# EAGLE board NEW MEIN (EAGLE 9.6.2), part 1 of 2
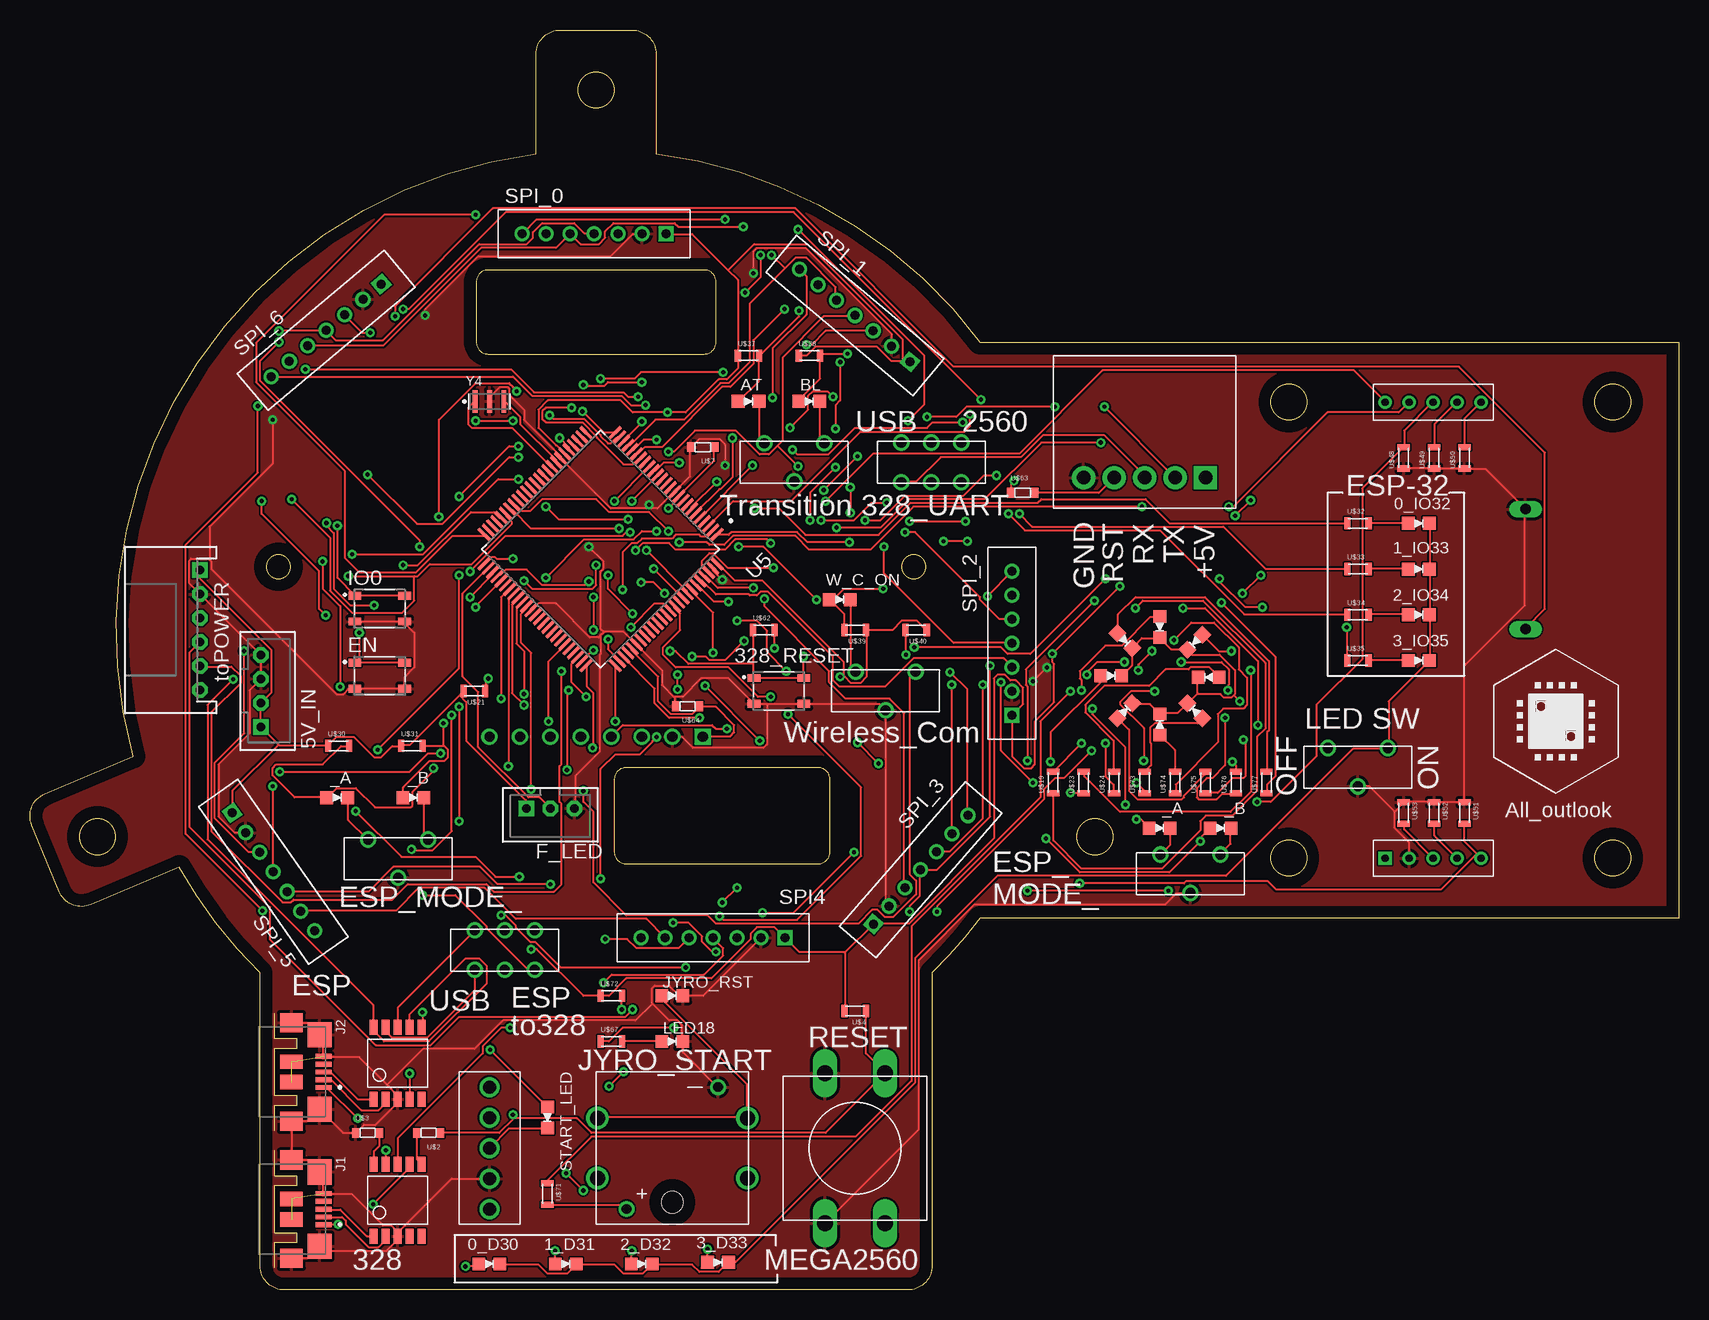
[diagram p2: board, top side]
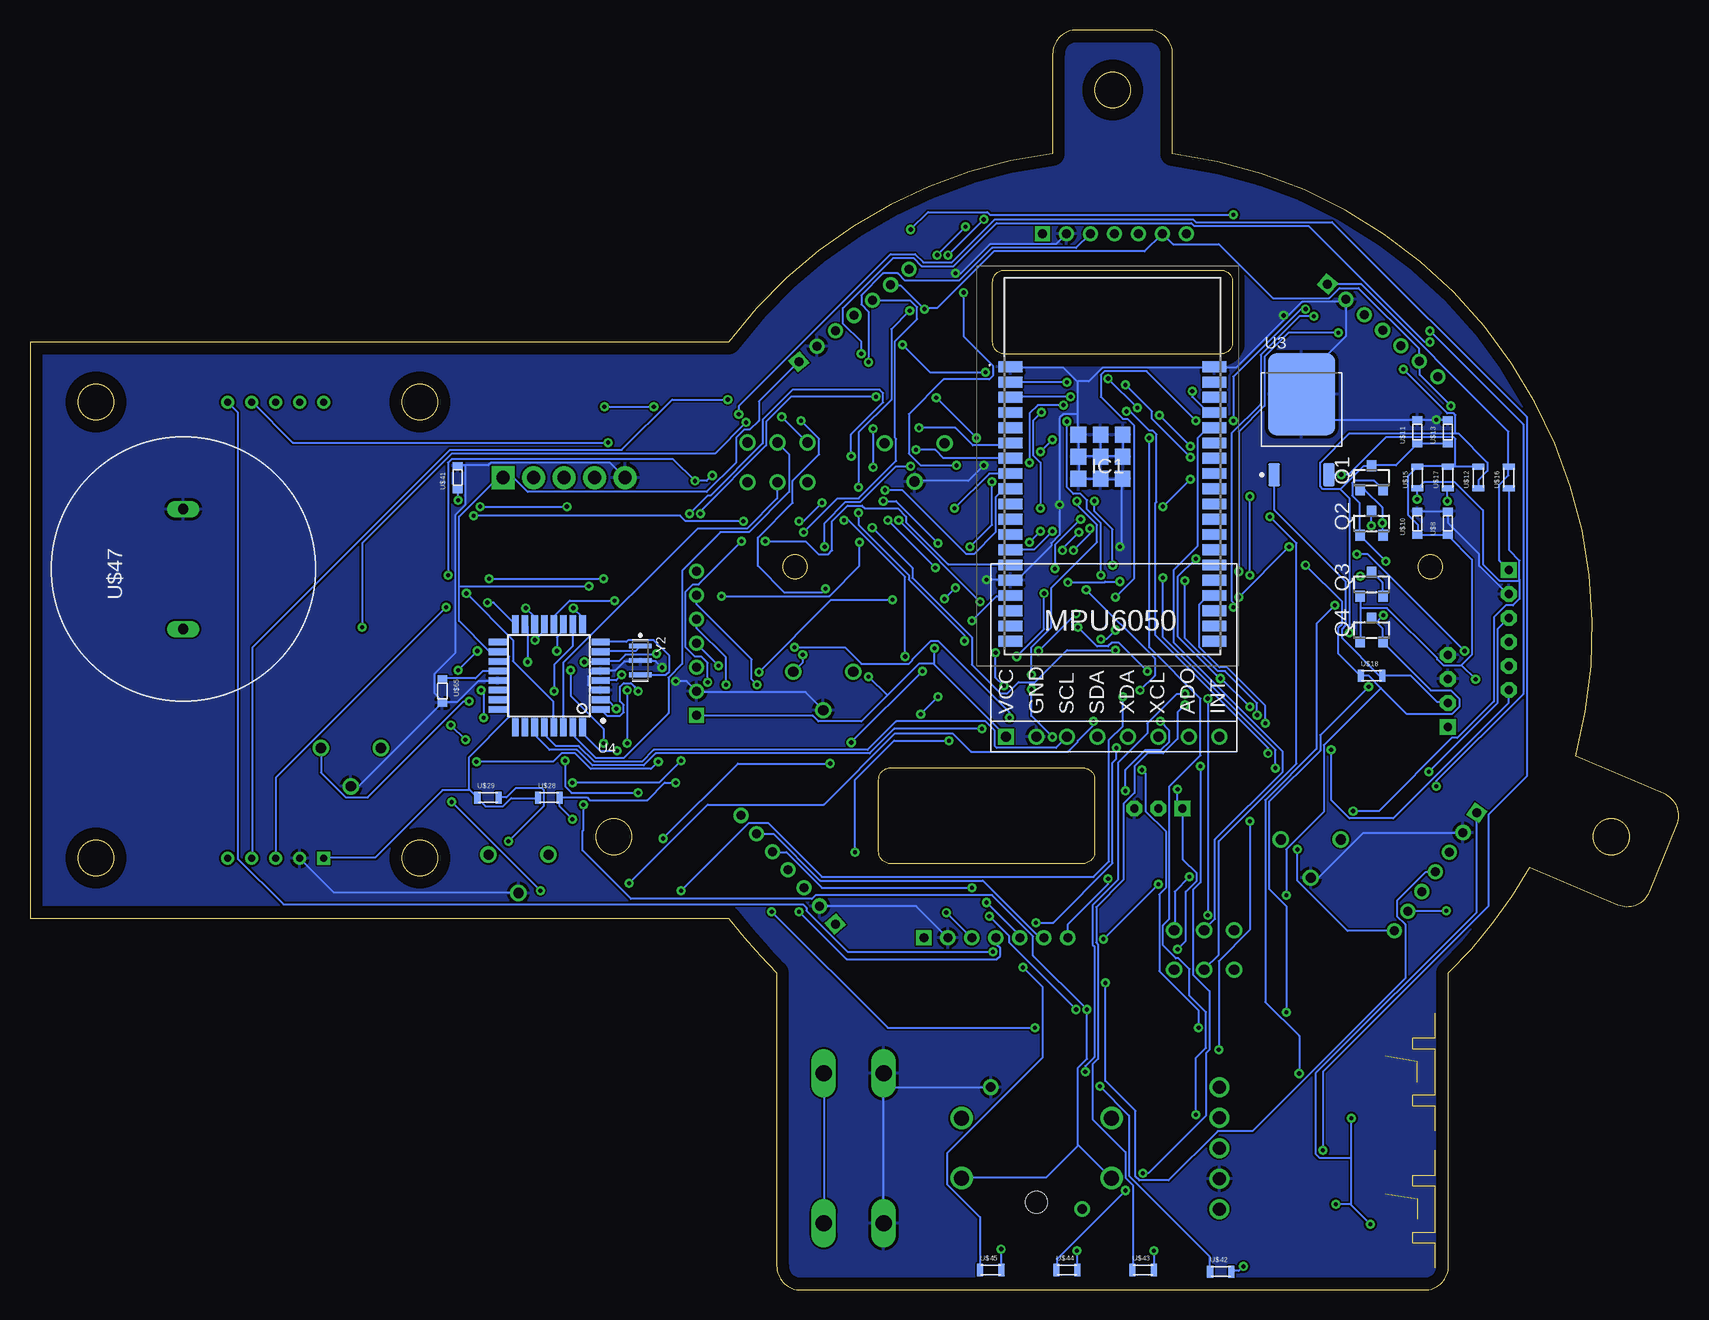
[diagram p3: board, bottom side, seen from below]

Size 137.44 x 105 mm. Coordinates in mm from the lower left corner, seen from the top.
Outline: 49.69,35.52 65.69,35.52 arc90 66.69,36.52 66.69,42.52 arc90 65.69,43.52 49.69,43.52 arc90 48.69,42.52 48.69,36.52 arc90 49.69,35.52
Outline: 56.19,85 38.19,85 arc90 37.19,84 37.19,79 arc90 38.19,78 56.19,78 arc90 57.19,79 57.19,84 arc90 56.19,85
Outline: 1.22,41.34 8.6,44.47 arc-98 42.19,94.68 42.19,103 arc-90 44.19,105 50.19,105 arc-90 52.19,103 52.19,94.68 arc-46 79.19,79 137.44,79 137.44,31 79.19,31 arc-9 75.19,26.43 75.19,2 arc-90 73.19,0 21.19,0 arc-90 19.19,2 19.19,26.43 arc-16 12.42,35.23 5.07,32.11 arc-91 2.44,33.19 0.15,38.74 arc-89 1.22,41.34
Outline: circle at 47.19,100 radius 1.5
Outline: circle at 88.77,37.78 radius 1.5
Outline: circle at 20.71,60.26 radius 1
Outline: circle at 73.67,60.26 radius 1
Outline: circle at 131.94,74 radius 1.5
Outline: circle at 131.94,36 radius 1.5
Outline: circle at 104.94,74 radius 1.5
Outline: circle at 104.94,36 radius 1.5
Outline: circle at 5.62,37.78 radius 1.5
Copper layers (1*16): Top 0.035mm / dielectric 1.5mm / Bottom 0.035mm
Design rules "default": minimum track width 6mil, minimum drill 0.35mm, track to track 6mil, track to pad 6mil, pad to pad 6mil, via to via 6mil, smd to smd 6mil, copper to edge 40mil, drill to drill 6mil, minimum pad ring 10mil, minimum via ring 8mil, stop-mask expansion 4mil, vias tented up to drill 0mil, thermal gap 10mil

## Footprints (pad centres in the part's own frame; a part is rotated, then mirrored left to right if it is on the bottom)
LED1608 = smd 1.05 x 1.08: A -0.875,0; K 0.875,0
SW_SKRPACE010 = smd 1.05 x 0.65: 1 -2.075,1.075; 2 2.075,1.075; 3 -2.075,-1.075; 4 2.075,-1.075
ESP32WROVEREM213EH2864PH3Q0 = smd 2 x 0.9: 1 -8.5,23.96; 2 -8.5,22.69; 3 -8.5,21.42; 4 -8.5,20.15; 5 -8.5,18.88; 6 -8.5,17.61; 7 -8.5,16.34; 8 -8.5,15.07; 9 -8.5,13.8; 10 -8.5,12.53; 11 -8.5,11.26; 12 -8.5,9.99; 13 -8.5,8.72; 14 -8.5,7.45; 15 -8.5,6.18; 16 -8.5,4.91; 17 -8.5,3.64; 18 -8.5,2.37; 19 -8.5,1.1; 20 8.5,1.1; 21 8.5,2.37; 22 8.5,3.64; 23 8.5,4.91; 24 8.5,6.18; 25 8.5,7.45; 26 8.5,8.72; 27 8.5,9.99; 28 8.5,11.26; 29 8.5,12.53; 30 8.5,13.8; 31 8.5,15.07; 32 8.5,16.34; 33 8.5,17.61; 34 8.5,18.88; 35 8.5,20.15; 36 8.5,21.42; 37 8.5,22.69; 38 8.5,23.96 | smd 1.33 x 1.33: 39 -1,16.46; 40 0.835,16.46; 41 0.835,14.625; 42 -1,14.625; 43 -2.835,14.625; 44 -2.835,16.46; 45 -2.835,18.295; 46 -1,18.295; 47 0.835,18.295
HRS_ZX62R-B-5P = smd 0.4 x 1.35: 1 1.3,2.675; 2 0.65,2.675; 3 0,2.675; 4 -0.65,2.675; 5 -1.3,2.675 | smd 2.1 x 2: S1 -3.1,2.35; S2 3.1,2.35 | smd 1.6 x 1.9: S3 -4.1,0; S4 4.1,0 | smd 1.2 x 1.9: S5 -0.85,0; S6 0.85,0
SOT23 = smd 0.8 x 0.9: 1 -0.95,-1; 2 0.95,-1; 3 0,1
DPAK228P968X238-4N = smd 0.96 x 1.9: 1 -2.28,-4.59; 3 2.28,-4.59 | smd 5.63 x 6.84: 2 0,2.12
QFP80P900X900X120-32N = smd 1.5 x 0.55: 1 -4.3,2.8; 2 -4.3,2; 3 -4.3,1.2; 4 -4.3,0.4; 5 -4.3,-0.4; 6 -4.3,-1.2; 7 -4.3,-2; 8 -4.3,-2.8; 17 4.3,-2.8; 18 4.3,-2; 19 4.3,-1.2; 20 4.3,-0.4; 21 4.3,0.4; 22 4.3,1.2; 23 4.3,2; 24 4.3,2.8 | smd 0.55 x 1.5: 9 -2.8,-4.3; 10 -2,-4.3; 11 -1.2,-4.3; 12 -0.4,-4.3; 13 0.4,-4.3; 14 1.2,-4.3; 15 2,-4.3; 16 2.8,-4.3; 25 2.8,4.3; 26 2,4.3; 27 1.2,4.3; 28 0.4,4.3; 29 -0.4,4.3; 30 -1.2,4.3; 31 -2,4.3; 32 -2.8,4.3
QFP50P1600X1600X120-100N = smd 1.47 x 0.28: 1 -7.67,6; 2 -7.67,5.5; 3 -7.67,5; 4 -7.67,4.5; 5 -7.67,4; 6 -7.67,3.5; 7 -7.67,3; 8 -7.67,2.5; 9 -7.67,2; 10 -7.67,1.5; 11 -7.67,1; 12 -7.67,0.5; 13 -7.67,0; 14 -7.67,-0.5; 15 -7.67,-1; 16 -7.67,-1.5; 17 -7.67,-2; 18 -7.67,-2.5; 19 -7.67,-3; 20 -7.67,-3.5; 21 -7.67,-4; 22 -7.67,-4.5; 23 -7.67,-5; 24 -7.67,-5.5; 25 -7.67,-6; 51 7.67,-6; 52 7.67,-5.5; 53 7.67,-5; 54 7.67,-4.5; 55 7.67,-4; 56 7.67,-3.5; 57 7.67,-3; 58 7.67,-2.5; 59 7.67,-2; 60 7.67,-1.5; 61 7.67,-1; 62 7.67,-0.5; 63 7.67,0; 64 7.67,0.5; 65 7.67,1; 66 7.67,1.5; 67 7.67,2; 68 7.67,2.5; 69 7.67,3; 70 7.67,3.5; 71 7.67,4; 72 7.67,4.5; 73 7.67,5; 74 7.67,5.5; 75 7.67,6 | smd 0.28 x 1.47: 26 -6,-7.67; 27 -5.5,-7.67; 28 -5,-7.67; 29 -4.5,-7.67; 30 -4,-7.67; 31 -3.5,-7.67; 32 -3,-7.67; 33 -2.5,-7.67; 34 -2,-7.67; 35 -1.5,-7.67; 36 -1,-7.67; 37 -0.5,-7.67; 38 0,-7.67; 39 0.5,-7.67; 40 1,-7.67; 41 1.5,-7.67; 42 2,-7.67; 43 2.5,-7.67; 44 3,-7.67; 45 3.5,-7.67; 46 4,-7.67; 47 4.5,-7.67; 48 5,-7.67; 49 5.5,-7.67; 50 6,-7.67; 76 6,7.67; 77 5.5,7.67; 78 5,7.67; 79 4.5,7.67; 80 4,7.67; 81 3.5,7.67; 82 3,7.67; 83 2.5,7.67; 84 2,7.67; 85 1.5,7.67; 86 1,7.67; 87 0.5,7.67; 88 0,7.67; 89 -0.5,7.67; 90 -1,7.67; 91 -1.5,7.67; 92 -2,7.67; 93 -2.5,7.67; 94 -3,7.67; 95 -3.5,7.67; 96 -4,7.67; 97 -4.5,7.67; 98 -5,7.67; 99 -5.5,7.67; 100 -6,7.67
CH340K = smd 0.635 x 1.27: P$1 0.5,-1; P$2 1.5,-1; P$3 2.5,-1; P$4 3.5,-1; P$5 4.5,-1; P$6 4.5,5; P$7 3.5,5; P$8 2.5,5; P$9 1.5,5; P$10 0.5,5
CON = smd 0.6 x 0.813: P$1 -1,0; P$2 1,0
1608 = smd 0.508 x 1.016: P$1 -0.889,0; P$2 0.889,0
12 = drill 1.35 long: P$1 -6.25,2.5; P$2 -6.25,-2.5; P$3 6.25,-2.5; P$4 6.25,2.5
2SW = drill 0.85: P$1 -2.5,1.65; P$2 0,1.65; P$3 2.5,1.65; P$4 2.5,-1.65; P$5 0,-1.65; P$6 -2.5,-1.65
S = drill 1.1: P$1 0,-5.08; P$2 0,-2.54; P$3 0,0; P$4 0,2.54; P$5 0,5.08
SSW = drill 0.85: P$1 -2.5,1.6; P$2 2.5,1.6; P$3 0,-1.6
ジャイロ = drill 0.85 square: P$1 1.27,1.27 | drill 0.85: P$2 3.81,1.27; P$3 6.35,1.27; P$4 8.89,1.27; P$5 11.43,1.27; P$6 13.97,1.27; P$7 16.51,1.27; P$8 19.05,1.27
BUZA = drill 0.85 long: P$1 -5,0; P$2 5,0
SPI = drill 0.75 square: P$1 0,0 | drill 0.75: P$2 2,0; P$3 4,0; P$4 6,0; P$5 8,0; P$6 10,0; P$7 12,0
SI = drill 1.1 pad 1.93 square: P$1 -7.62,0 | drill 1.1 pad 1.93: P$2 -5.08,0; P$3 -2.54,0; P$4 0,0; P$5 2.54,0
UI = drill 0.6 square: P$1 1,-1.5 | drill 0.6: P$2 3,-1.5; P$3 5,-1.5; P$4 7,-1.5; P$5 9,-1.5; P$6 9,36.5; P$7 7,36.5; P$8 5,36.5; P$9 3,36.5; P$10 1,36.5
SWLED = drill 1.25: 1 -6.25,-2.5; 2 6.25,-2.5; 3 -6.25,2.5; 4 6.25,2.5 | drill 0.8: + -3.81,-5.08; - 3.81,5.08 | hole 1.8: 0,-4.5
B4B-PH-K-S = drill 0.7 pad 1.3 square: 1 3,0 | drill 0.7 pad 1.3 octagon: 2 1,0; 3 -1,0; 4 -3,0
B3B-PH-K-S = drill 0.7 pad 1.3 square: 1 2,0 | drill 0.7 pad 1.3 octagon: 2 0,0; 3 -2,0
S6B-PH-K-S = drill 0.7 pad 1.3 square: 1 5,0 | drill 0.7 pad 1.3 octagon: 2 3,0; 3 1,0; 4 -1,0; 5 -3,0; 6 -5,0
OSC_CSTCE16M0V53-R0 = smd 0.4 x 1.9: 1 -1.2,0; 2 0,0; 3 1.2,0

## Placement (x,y rotation side)
0_D30  LED1608  [LED1608]  38.3,2.16 0 top
0_IO32  LED1608  [LED1608]  115.77,63.89 0 top
1_D31  LED1608  [LED1608]  44.65,2.16 0 top
1_IO33  LED1608  [LED1608]  115.77,60.08 0 top
2_D32  LED1608  [LED1608]  51,2.16 0 top
2_IO34  LED1608  [LED1608]  115.77,56.27 0 top
3_D33  LED1608  [LED1608]  57.35,2.29 0 top
3_IO35  LED1608  [LED1608]  115.77,52.46 0 top
328_RESET  SKRPACE010  [SW_SKRPACE010]  62.43,49.92 0 top
AT  LED1608  [LED1608]  59.89,74.05 0 top
BL  LED1608  [LED1608]  64.97,74.05 0 top
EN  SKRPACE010  [SW_SKRPACE010]  29.16,51.19 0 top
IC1  ESP32-WROVER-E_M213EH2864PH3Q0  [ESP32WROVEREM213EH2864PH3Q0]  47.19,52.96 0 bottom
IO0  SKRPACE010  [SW_SKRPACE010]  29.16,56.77 0 top
J1  ZX62R-B-5P  [HRS_ZX62R-B-5P]  21.79,6.74 270 top
J2  ZX62R-B-5P  [HRS_ZX62R-B-5P]  21.79,18.17 270 top
JYRO_RST  LED1608  [LED1608]  53.54,24.52 0 top
LED1  LED1608  [LED1608]  94.18,55.25 270 top
LED18  LED1608  [LED1608]  53.54,20.71 0 top
LED21  LED1608  [LED1608]  97.1,53.98 225 top
LED22  LED1608  [LED1608]  98.25,51.06 180 top
LED23  LED1608  [LED1608]  97.1,48.27 135 top
LED24  LED1608  [LED1608]  94.18,47.12 90 top
LED25  LED1608  [LED1608]  91.26,48.27 45 top
LED26  LED1608  [LED1608]  90.12,51.19 0 top
LED27  LED1608  [LED1608]  91.26,54.11 315 top
Q1  BSS138  [SOT23]  25.6,67.7 0 bottom
Q2  BSS138  [SOT23]  25.6,63.89 0 bottom
Q3  BSS138  [SOT23]  25.6,58.81 0 bottom
Q4  BSS138  [SOT23]  25.6,55 0 bottom
START_LED  LED1608  [LED1608]  43.13,14.36 270 top
U3  NJM2845DL1-33-TE1  [DPAK228P968X238-4N]  31.44,72.52 0 bottom
U4  ATMEGA328P-AU  [QFP80P900X900X120-32N]  94.18,51.19 180 bottom
U5  ATMEGA2560-16AU  [QFP50P1600X1600X120-100N]  47.56,61.74 225 top
U$1  CH340K  [CH340K]  28.14,5.47 0 top
U$2  1608  [CON]  33.22,13.09 180 top
U$3  1608  [CON]  28.14,13.09 0 top
U$4  R  [1608]  68.78,23.25 180 top
U$5  ALL  [ALL]  127.2,47.38 0 top
U$6  TAKUTO  [12]  68.78,11.82 90 top
U$7  1608  [CON]  56.08,70.24 180 top
U$8  1608  [CON]  19.25,63.89 90 bottom
U$9  CH340K  [CH340K]  28.14,16.9 0 top
U$10  1608  [CON]  21.79,63.89 90 bottom
U$11  1608  [CON]  21.79,71.51 90 bottom
U$12  R  [1608]  16.71,67.7 90 bottom
U$13  1608  [CON]  19.25,71.51 90 bottom
U$14  2SW  [2SW]  39.57,28.33 0 top
U$15  R  [1608]  21.79,67.7 90 bottom
U$16  R  [1608]  14.17,67.7 90 bottom
U$17  R  [1608]  19.25,67.7 90 bottom
U$18  R  [1608]  25.6,51.19 0 bottom
U$19  R  [1608]  85.29,42.3 90 top
U$20  S  [S]  38.3,11.82 0 top
U$21  R  [1608]  37.03,49.92 180 top
U$22  SSW  [SSW]  63.7,68.97 0 top
U$23  R  [1608]  87.83,42.3 90 top
U$24  R  [1608]  90.37,42.3 90 top
U$25  ジャイロ  [ジャイロ]  57.35,44.84 0 bottom
U$26  SSW  [SSW]  96.72,34.68 0 top
U$27  SSW  [SSW]  30.68,35.95 0 top
U$28  R  [1608]  94.18,41.03 0 bottom
U$29  R  [1608]  99.26,41.03 0 bottom
U$30  R  [1608]  25.73,45.34 0 top
U$31  R  [1608]  31.82,45.34 0 top
U$32  R  [1608]  110.69,63.89 0 top
U$33  R  [1608]  110.69,60.08 0 top
U$34  R  [1608]  110.69,56.27 0 top
U$35  R  [1608]  110.69,52.46 0 top
U$36  SSW  [SSW]  71.32,49.92 0 top
U$37  R  [1608]  59.89,77.86 0 top
U$38  R  [1608]  64.97,77.86 0 top
U$39  R  [1608]  68.78,55 180 top
U$40  R  [1608]  73.86,55 180 top
U$41  1608  [CON]  101.8,67.7 90 bottom
U$42  R  [1608]  38.17,1.53 0 bottom
U$43  R  [1608]  44.65,1.66 0 bottom
U$44  R  [1608]  51,1.66 0 bottom
U$45  R  [1608]  57.35,1.66 0 bottom
U$47  BUZA  [BUZA]  124.66,60.08 90 bottom
U$48  R  [1608]  114.5,69.35 90 top
U$49  R  [1608]  117.04,69.35 90 top
U$50  R  [1608]  119.58,69.35 90 top
U$51  R  [1608]  119.58,39.76 270 top
U$52  R  [1608]  117.04,39.76 270 top
U$53  R  [1608]  114.5,39.76 270 top
U$54  SPI  [SPI]  73.35,77.35 140 top
U$55  SPI  [SPI]  70.31,30.49 49 top
U$56  SPI  [SPI]  81.86,47.88 90 top
U$57  SPI  [SPI]  53.03,88.02 180 top
U$58  SPI  [SPI]  62.94,29.34 180 top
U$59  SPI  [SPI]  29.28,83.83 220 top
U$60  SPI  [SPI]  16.84,39.76 305 top
U$62  R  [1608]  61.16,55 0 top
U$63  1608  [CON]  82.75,66.43 0 top
U$64  1608  [CON]  54.81,48.65 180 top
U$65  1608  [CON]  103.07,49.92 270 bottom
U$66  SI  [SI]  90.37,67.7 180 top
U$67  R  [1608]  48.46,20.71 0 top
U$68  UI  [UI]  111.96,37.47 0 top
U$69  2SW  [2SW]  75.13,68.97 0 top
U$70  SWLED  [SWLED]  53.54,11.82 0 top
U$71  R  [1608]  43.13,8.01 270 top
U$72  R  [1608]  48.46,24.52 0 top
U$73  R  [1608]  92.91,42.3 90 top
U$74  R  [1608]  95.45,42.3 90 top
U$75  R  [1608]  97.99,42.3 90 top
U$76  R  [1608]  100.53,42.3 90 top
U$77  R  [1608]  103.07,42.3 90 top
U$78  SSW  [SSW]  110.69,43.57 0 top
W_C_ON  LED1608  [LED1608]  67.51,57.54 0 top
X2  B4B-PH-K-S  [B4B-PH-K-S]  19.25,49.92 270 top
X3  B3B-PH-K-S  [B3B-PH-K-S]  43.38,40.14 180 top
X4  S6B-PH-K-S  [S6B-PH-K-S]  14.17,55 90 top
Y2  CSTCE16M0V53-R0  [OSC_CSTCE16M0V53-R0]  86.56,52.46 270 bottom
Y4  CSTCE16M0V53-R0  [OSC_CSTCE16M0V53-R0]  38.3,74.05 0 top
Ⅰ_A  LED1608  [LED1608]  94.18,38.49 0 top
Ⅰ_B  LED1608  [LED1608]  99.26,38.49 0 top
Ⅱ_A  LED1608  [LED1608]  25.6,41.03 0 top
Ⅱ_B  LED1608  [LED1608]  31.95,41.03 0 top